# Altium schematic sheet HalfBridge V01.SchDoc
size 381 x 241 mm
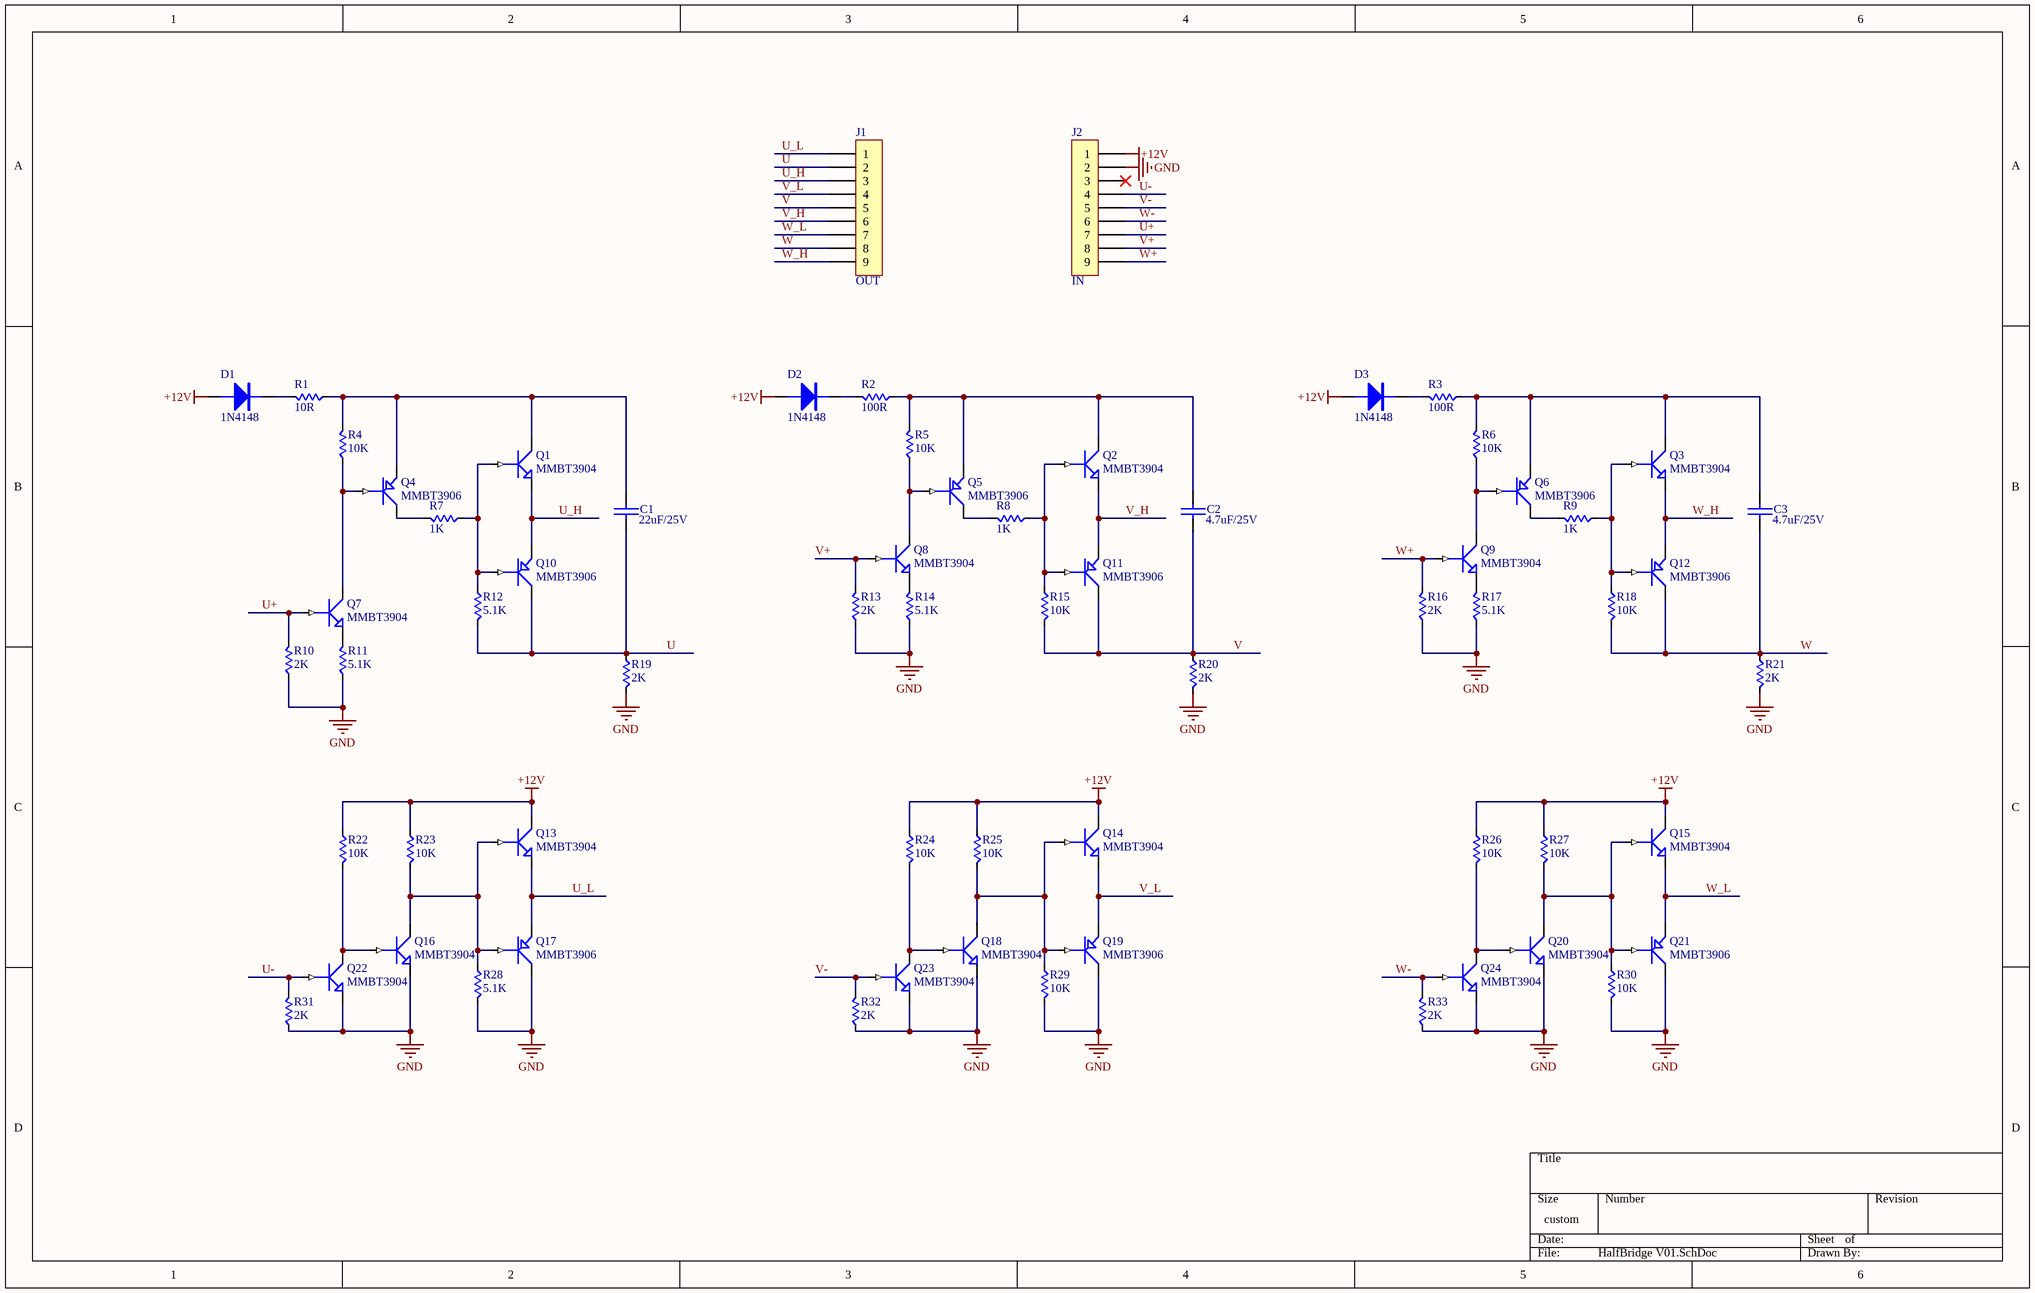
[diagram p0: HalfBridge V01.SchDoc]

## Parts
C1  22uF/25V  [0805C]
C2  4.7uF/25V  [0805C]
C3  4.7uF/25V  [0805C]
D1  1N4148  [SOD-123]
D2  1N4148  [SOD-123]
D3  1N4148  [SOD-123]
J1  OUT  [SMT2.54-1X9-F]
J2  IN  [SMT2.54-1X9-F]
Q1  MMBT3904  [SOT-23S]
Q2  MMBT3904  [SOT-23S]
Q3  MMBT3904  [SOT-23S]
Q4  MMBT3906  [SOT-23S]
Q5  MMBT3906  [SOT-23S]
Q6  MMBT3906  [SOT-23S]
Q7  MMBT3904  [SOT-23S]
Q8  MMBT3904  [SOT-23S]
Q9  MMBT3904  [SOT-23S]
Q10  MMBT3906  [SOT-23S]
Q11  MMBT3906  [SOT-23S]
Q12  MMBT3906  [SOT-23S]
Q13  MMBT3904  [SOT-23S]
Q14  MMBT3904  [SOT-23S]
Q15  MMBT3904  [SOT-23S]
Q16  MMBT3904  [SOT-23S]
Q17  MMBT3906  [SOT-23S]
Q18  MMBT3904  [SOT-23S]
Q19  MMBT3906  [SOT-23S]
Q20  MMBT3904  [SOT-23S]
Q21  MMBT3906  [SOT-23S]
Q22  MMBT3904  [SOT-23S]
Q23  MMBT3904  [SOT-23S]
Q24  MMBT3904  [SOT-23S]
R1  10R  [0603R]
R2  100R  [0603R]
R3  100R  [0603R]
R4  10K  [0603R]
R5  10K  [0603R]
R6  10K  [0603R]
R7  1K  [0603R]
R8  1K  [0603R]
R9  1K  [0603R]
R10  2K  [0603R]
R11  5.1K  [0603R]
R12  5.1K  [0603R]
R13  2K  [0603R]
R14  5.1K  [0603R]
R15  10K  [0603R]
R16  2K  [0603R]
R17  5.1K  [0603R]
R18  10K  [0603R]
R19  2K  [0603R]
R20  2K  [0603R]
R21  2K  [0603R]
R22  10K  [0603R]
R23  10K  [0603R]
R24  10K  [0603R]
R25  10K  [0603R]
R26  10K  [0603R]
R27  10K  [0603R]
R28  5.1K  [0603R]
R29  10K  [0603R]
R30  10K  [0603R]
R31  2K  [0603R]
R32  2K  [0603R]
R33  2K  [0603R]

## Nets
+12V: D1.1 D2.1 D3.1 J2.1 Q13.3(C) Q14.3(C) Q15.3(C) R22.1 R23.1 R24.1 R25.1 R26.1 R27.1
GND: J2.2 Q16.2(E) Q17.3(C) Q18.2(E) Q19.3(C) Q20.2(E) Q21.3(C) Q22.2(E) Q23.2(E) Q24.2(E) R10.1 R11.1 R13.1 R14.1 R16.1 R17.1 R19.1 R20.1 R21.1 R28.2 R29.2 R30.2 R31.1 R32.1 R33.1
U: C1.2 J1.2 Q10.3(C) R12.2 R19.2
U+: J2.7 Q7.1(B) R10.2
U-: J2.4 Q22.1(B) R31.2
U_H: J1.3 Q1.2(E) Q10.2(E)
U_L: J1.1 Q13.2(E) Q17.2(E)
V: C2.2 J1.5 Q11.3(C) R15.2 R20.2
V+: J2.8 Q8.1(B) R13.2
V-: J2.5 Q23.1(B) R32.2
V_H: J1.6 Q2.2(E) Q11.2(E)
V_L: J1.4 Q14.2(E) Q19.2(E)
W: C3.2 J1.8 Q12.3(C) R18.2 R21.2
W+: J2.9 Q9.1(B) R16.2
W-: J2.6 Q24.1(B) R33.2
W_H: J1.9 Q3.2(E) Q12.2(E)
W_L: J1.7 Q15.2(E) Q21.2(E)
NetC1_1: C1.1 Q1.3(C) Q4.2(E) R1.1 R4.2
NetC2_1: C2.1 Q2.3(C) Q5.2(E) R2.1 R5.2
NetC3_1: C3.1 Q3.3(C) Q6.2(E) R3.1 R6.2
NetD1_2: D1.2 R1.2
NetD2_2: D2.2 R2.2
NetD3_2: D3.2 R3.2
NetQ1_1: Q1.1(B) Q10.1(B) R7.1 R12.1
NetQ2_1: Q2.1(B) Q11.1(B) R8.1 R15.1
NetQ3_1: Q3.1(B) Q12.1(B) R9.1 R18.1
NetQ4_1: Q4.1(B) Q7.3(C) R4.1
NetQ4_3: Q4.3(C) R7.2
NetQ5_1: Q5.1(B) Q8.3(C) R5.1
NetQ5_3: Q5.3(C) R8.2
NetQ6_1: Q6.1(B) Q9.3(C) R6.1
NetQ6_3: Q6.3(C) R9.2
NetQ7_2: Q7.2(E) R11.2
NetQ8_2: Q8.2(E) R14.2
NetQ9_2: Q9.2(E) R17.2
NetQ13_1: Q13.1(B) Q16.3(C) Q17.1(B) R23.2 R28.1
NetQ14_1: Q14.1(B) Q18.3(C) Q19.1(B) R25.2 R29.1
NetQ15_1: Q15.1(B) Q20.3(C) Q21.1(B) R27.2 R30.1
NetQ16_1: Q16.1(B) Q22.3(C) R22.2
NetQ18_1: Q18.1(B) Q23.3(C) R24.2
NetQ20_1: Q20.1(B) Q24.3(C) R26.2

Not connected (* = marked no-connect by the designer): J2 3*

## Library data of the parts
C1-C3 = CAP: Capacitor
D1-D3 = DIODE1: Diode
J1 J2 = CON9: Connector
Q1-Q3 Q7-Q9 Q13-Q16 Q18 Q20 Q22-Q24 = NPN1: NPN Transistor
Q4-Q6 Q10-Q12 Q17 Q19 Q21 = PNP1: PNP Transistor
R1-R33 = Res